# EAGLE design micro_opto_v1.2 (EAGLE 6.4)
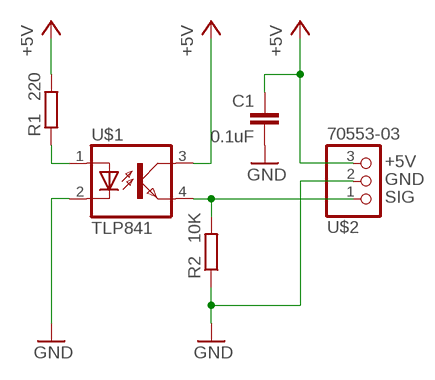
[diagram p0: schematic, sheet 1]

## Parts
C1  0.1uF  C-EUC0805  [C0805]
R1  220  R-EU_R0805  [R0805]
R2  10K  R-EU_R0805  [R0805]
U$1  TLP841  [TLP841]
U$2  70553-03  [70553-03]

## Nets
+5V: C1.1 R1.2 U$1.3(COL) U$2.3
GND: C1.2 R2.1 U$1.2(C) U$2.2
N$2: R1.1 U$1.1(A)
SIG: R2.2 U$1.4(EMIT) U$2.1

## Notes on the sheet
- +5V
- GND
- SIG

## Library data of the parts
C1 = rcl_mod:C-EU: CAPACITOR, European symbol
R1 R2 = rcl_mod:R-EU_: RESISTOR, European symbol
U$1 = TLP841:TLP841
U$2 = 70553-03:70553-03

## Board
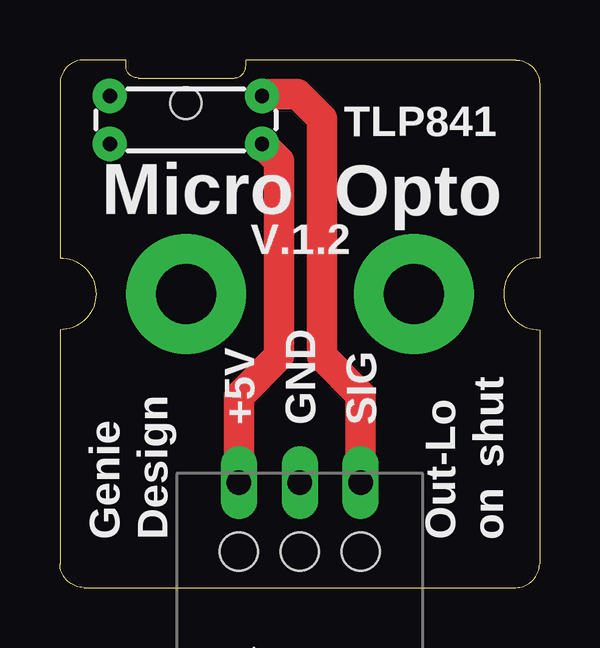
[diagram p1: board, top side]
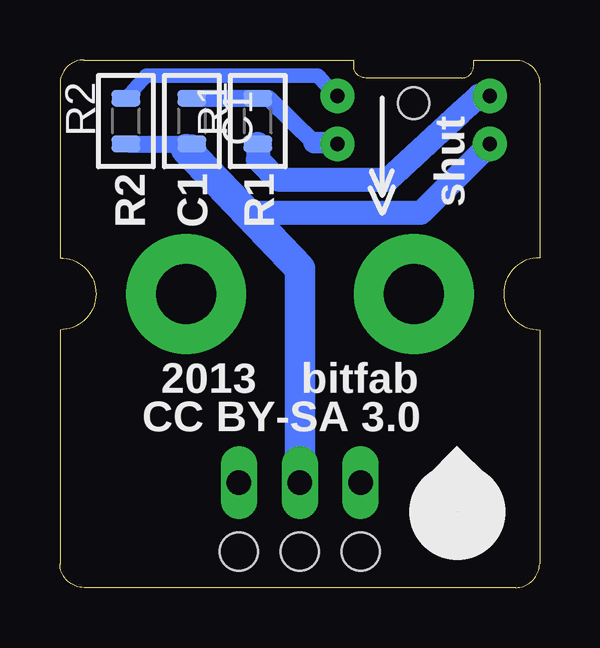
[diagram p2: board, bottom side, seen from below]

Size 20 x 22 mm. Coordinates in mm from the lower left corner, seen from the top.
Outline: 19,22 7.75,22 7.75,21.75 arc-90 7.25,21.25 3.25,21.25 arc-90 2.75,21.75 2.75,22 1,22 arc90 0,21 0,13.75 arc-90 1.5,12.25 arc-90 0,10.75 0,1 arc90 1,0 19,0 arc90 20,1 20,10.75 arc-90 18.5,12.25 arc-90 20,13.75 20,21 arc90 19,22
Copper layers (1*16): Top 0.035mm / dielectric 1.5mm / Bottom 0.035mm
Design rules "Fusion_eagle_rule_v1.1 *": minimum track width 6mil, minimum drill 12mil, track to track 6mil, track to pad 6mil, pad to pad 6mil, via to via 6mil, smd to smd 0mil, copper to edge 10mil, drill to drill 10mil, minimum pad ring 10mil, minimum via ring 6mil, stop-mask expansion 2mil, vias tented up to drill 100mil, thermal gap 10mil
Holes 1.6 mm at 10,1.5 7.46,1.5 12.54,1.5

### Footprints (pad centres in the part's own frame; a part is rotated, then mirrored left to right if it is on the bottom)
C0805 = smd 0.7 x 1.2: 1 -0.95,0; 2 0.95,0
R0805 = smd 0.7 x 1.2: 1 -0.95,0; 2 0.95,0
TLP841 = drill 0.6 pad 1.422: 1 -3.175,1; 2 -3.175,-1; 3 3.175,-1; 4 3.175,1 | hole 1.3: 0,0.7
70553-03 = drill 1.016 long: 1 2.54,0; 2 0,0; 3 -2.54,0

### Placement (x,y rotation side)
C1  14.5,19.45 270 bottom
R1  11.75,19.45 90 bottom
R2  17.25,19.45 90 bottom
U$1  5.25,19.5 0 top
U$2  10,4.38 0 top

### Tracks (layer width: path | path; a pad name or v marks a point on that pad's centre or on a via)
+5V
  Top 1.27: U$2.3 7.46,7.97 9.14,9.65 9.14,17.78 U$1.3
  Bottom 0.152: 14.48,20.4 C1.1 | R1.2 11.81,20.45 11.81,20.4
  Bottom 0.61: 8.47,18.54 U$1.3
  Bottom 0.7: 14.48,20.4 11.81,20.4 R1.2 11.3,20.4 9.4,18.54
  Bottom 0.9: 9.4,18.54 8.47,18.54
GND
  Bottom 0.152: 14.61,18.5 C1.2 | 17.14,18.5 R2.1
  Bottom 0.7: 17.14,18.5 14.61,18.5
  Bottom 0.813: U$1.2 | 12.32,15.62 14.73,18.29 14.48,18.48 C1.2
  Bottom 1: U$1.2 4.95,15.62 12.32,15.62
  Bottom 1.27: U$2.2 10,13.3 14.73,18.29
N$1  (via drill 2.5 pad 5)
  other vias: 5.25,12.25
N$2
  Bottom 1: R1.1 11.75,17.85 10.92,17.02 6.32,17.02 3.3,19.81 2.54,20.5 U$1.1
N$3  (via drill 2.5 pad 5)
  other vias: 14.75,12.25
SIG
  Top 1.27: U$2.1 12.54,8.03 10.92,9.65 10.92,19.56 9.91,20.57 8.5,20.57 U$1.4
  Bottom 0.61: U$1.4 8.5,20.5 9.25,21.35 16.4,21.35 R2.2

### Text on the board
tPlace: TLP841 | Micro | Opto | V.1.2 | +5V | GND | SIG | shut | Genie | Design | Out-Lo | on
bPlace: shut | R1 | C1 | R2 | bitfab | 2013 | CC BY-SA 3.0
Document: 22mm | 20mm